# Altium schematic sheet FPGA HP BANK.SchDoc
size A3
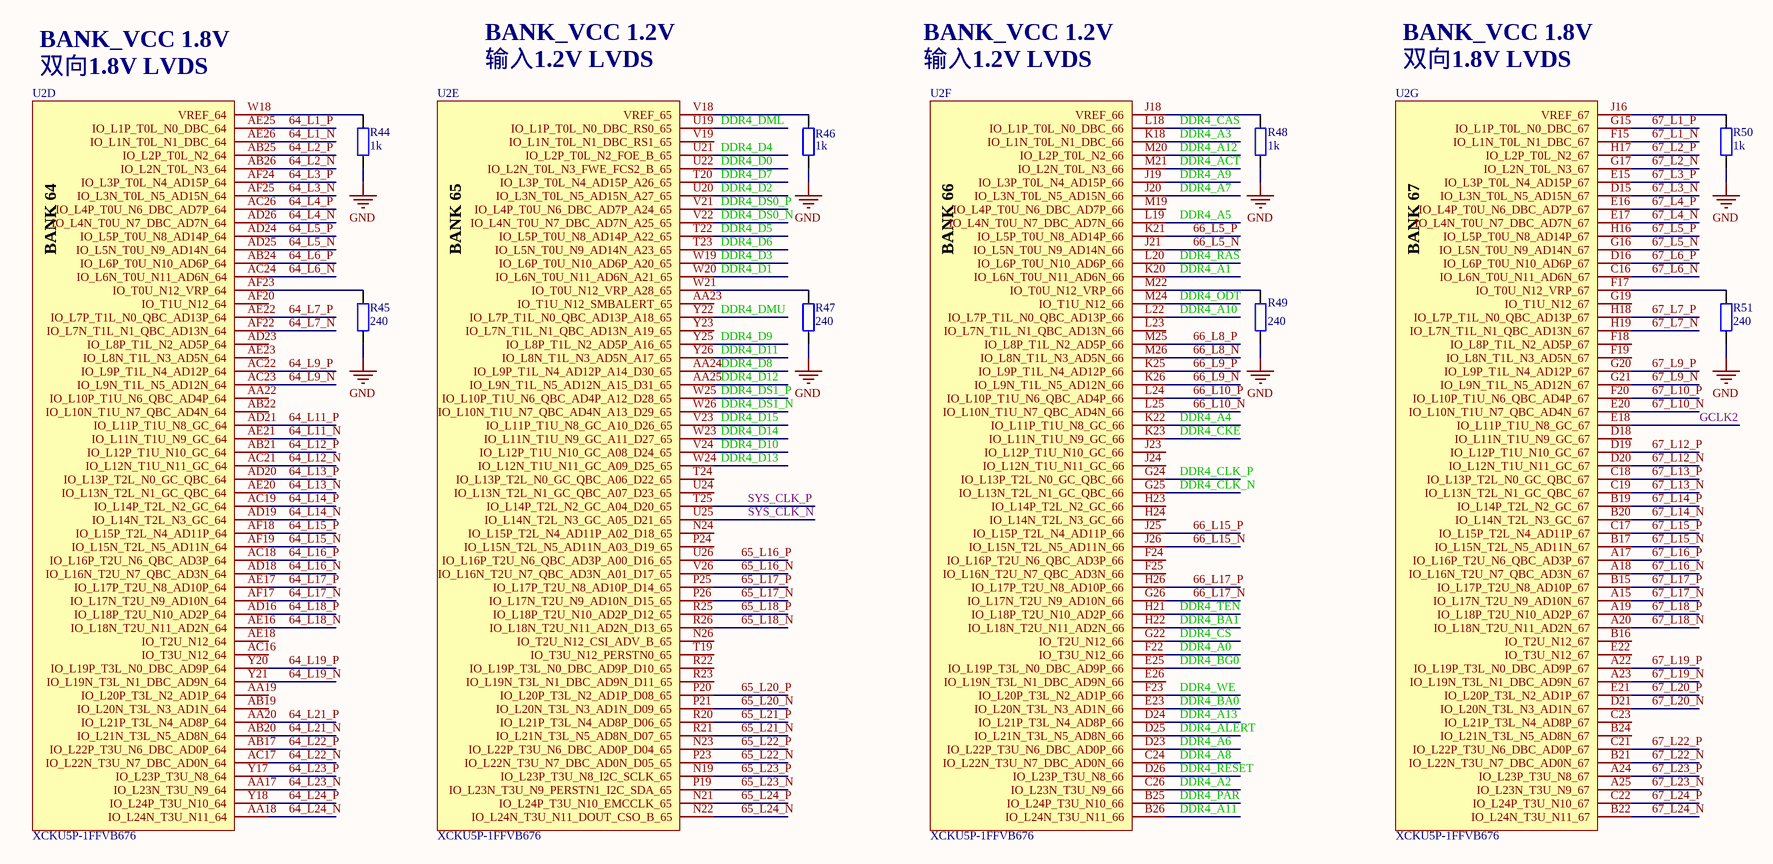
[diagram p0: FPGA HP BANK.SchDoc]

## Parts
R44  1k  [0402_R_M]
R45  240  [0402_R_M]
R46  1k  [0402_R_M]
R47  240  [0402_R_M]
R48  1k  [0402_R_M]
R49  240  [0402_R_M]
R50  1k  [0402_R_M]
R51  240  [0402_R_M]
U2  XCKU5P-1FFVB676  (parts D,E,F,G of 11)

## Nets
GND: R44.2 R45.2 R46.2 R47.2 R48.2 R49.2 R50.2 R51.2
64_L1_N: U2.AE26(IO_L1N_T0L_N1_DBC_64)
64_L1_P: U2.AE25(IO_L1P_T0L_N0_DBC_64)
64_L2_N: U2.AB26(IO_L2N_T0L_N3_64)
64_L2_P: U2.AB25(IO_L2P_T0L_N2_64)
64_L3_N: U2.AF25(IO_L3N_T0L_N5_AD15N_64)
64_L3_P: U2.AF24(IO_L3P_T0L_N4_AD15P_64)
64_L4_N: U2.AD26(IO_L4N_T0U_N7_DBC_AD7N_64)
64_L4_P: U2.AC26(IO_L4P_T0U_N6_DBC_AD7P_64)
64_L5_N: U2.AD25(IO_L5N_T0U_N9_AD14N_64)
64_L5_P: U2.AD24(IO_L5P_T0U_N8_AD14P_64)
64_L6_N: U2.AC24(IO_L6N_T0U_N11_AD6N_64)
64_L6_P: U2.AB24(IO_L6P_T0U_N10_AD6P_64)
64_L7_N: U2.AF22(IO_L7N_T1L_N1_QBC_AD13N_64)
64_L7_P: U2.AE22(IO_L7P_T1L_N0_QBC_AD13P_64)
64_L9_N: U2.AC23(IO_L9N_T1L_N5_AD12N_64)
64_L9_P: U2.AC22(IO_L9P_T1L_N4_AD12P_64)
64_L11_N: U2.AE21(IO_L11N_T1U_N9_GC_64)
64_L11_P: U2.AD21(IO_L11P_T1U_N8_GC_64)
64_L12_N: U2.AC21(IO_L12N_T1U_N11_GC_64)
64_L12_P: U2.AB21(IO_L12P_T1U_N10_GC_64)
64_L13_N: U2.AE20(IO_L13N_T2L_N1_GC_QBC_64)
64_L13_P: U2.AD20(IO_L13P_T2L_N0_GC_QBC_64)
64_L14_N: U2.AD19(IO_L14N_T2L_N3_GC_64)
64_L14_P: U2.AC19(IO_L14P_T2L_N2_GC_64)
64_L15_N: U2.AF19(IO_L15N_T2L_N5_AD11N_64)
64_L15_P: U2.AF18(IO_L15P_T2L_N4_AD11P_64)
64_L16_N: U2.AD18(IO_L16N_T2U_N7_QBC_AD3N_64)
64_L16_P: U2.AC18(IO_L16P_T2U_N6_QBC_AD3P_64)
64_L17_N: U2.AF17(IO_L17N_T2U_N9_AD10N_64)
64_L17_P: U2.AE17(IO_L17P_T2U_N8_AD10P_64)
64_L18_N: U2.AE16(IO_L18N_T2U_N11_AD2N_64)
64_L18_P: U2.AD16(IO_L18P_T2U_N10_AD2P_64)
64_L19_N: U2.Y21(IO_L19N_T3L_N1_DBC_AD9N_64)
64_L19_P: U2.Y20(IO_L19P_T3L_N0_DBC_AD9P_64)
64_L21_N: U2.AB20(IO_L21N_T3L_N5_AD8N_64)
64_L21_P: U2.AA20(IO_L21P_T3L_N4_AD8P_64)
64_L22_N: U2.AC17(IO_L22N_T3U_N7_DBC_AD0N_64)
64_L22_P: U2.AB17(IO_L22P_T3U_N6_DBC_AD0P_64)
64_L23_N: U2.AA17(IO_L23N_T3U_N9_64)
64_L23_P: U2.Y17(IO_L23P_T3U_N8_64)
64_L24_N: U2.AA18(IO_L24N_T3U_N11_64)
64_L24_P: U2.Y18(IO_L24P_T3U_N10_64)
65_L16_N: U2.V26(IO_L16N_T2U_N7_QBC_AD3N_A01_D17_65)
65_L16_P: U2.U26(IO_L16P_T2U_N6_QBC_AD3P_A00_D16_65)
65_L17_N: U2.P26(IO_L17N_T2U_N9_AD10N_D15_65)
65_L17_P: U2.P25(IO_L17P_T2U_N8_AD10P_D14_65)
65_L18_N: U2.R26(IO_L18N_T2U_N11_AD2N_D13_65)
65_L18_P: U2.R25(IO_L18P_T2U_N10_AD2P_D12_65)
65_L20_N: U2.P21(IO_L20N_T3L_N3_AD1N_D09_65)
65_L20_P: U2.P20(IO_L20P_T3L_N2_AD1P_D08_65)
65_L21_N: U2.R21(IO_L21N_T3L_N5_AD8N_D07_65)
65_L21_P: U2.R20(IO_L21P_T3L_N4_AD8P_D06_65)
65_L22_N: U2.P23(IO_L22N_T3U_N7_DBC_AD0N_D05_65)
65_L22_P: U2.N23(IO_L22P_T3U_N6_DBC_AD0P_D04_65)
65_L23_N: U2.P19(IO_L23N_T3U_N9_PERSTN1_I2C_SDA_65)
65_L23_P: U2.N19(IO_L23P_T3U_N8_I2C_SCLK_65)
65_L24_N: U2.N22(IO_L24N_T3U_N11_DOUT_CSO_B_65)
65_L24_P: U2.N21(IO_L24P_T3U_N10_EMCCLK_65)
66_L5_N: U2.J21(IO_L5N_T0U_N9_AD14N_66)
66_L5_P: U2.K21(IO_L5P_T0U_N8_AD14P_66)
66_L8_N: U2.M26(IO_L8N_T1L_N3_AD5N_66)
66_L8_P: U2.M25(IO_L8P_T1L_N2_AD5P_66)
66_L9_N: U2.K26(IO_L9N_T1L_N5_AD12N_66)
66_L9_P: U2.K25(IO_L9P_T1L_N4_AD12P_66)
66_L10_N: U2.L25(IO_L10N_T1U_N7_QBC_AD4N_66)
66_L10_P: U2.L24(IO_L10P_T1U_N6_QBC_AD4P_66)
66_L15_N: U2.J26(IO_L15N_T2L_N5_AD11N_66)
66_L15_P: U2.J25(IO_L15P_T2L_N4_AD11P_66)
66_L17_N: U2.G26(IO_L17N_T2U_N9_AD10N_66)
66_L17_P: U2.H26(IO_L17P_T2U_N8_AD10P_66)
67_L1_N: U2.F15(IO_L1N_T0L_N1_DBC_67)
67_L1_P: U2.G15(IO_L1P_T0L_N0_DBC_67)
67_L2_N: U2.G17(IO_L2N_T0L_N3_67)
67_L2_P: U2.H17(IO_L2P_T0L_N2_67)
67_L3_N: U2.D15(IO_L3N_T0L_N5_AD15N_67)
67_L3_P: U2.E15(IO_L3P_T0L_N4_AD15P_67)
67_L4_N: U2.E17(IO_L4N_T0U_N7_DBC_AD7N_67)
67_L4_P: U2.E16(IO_L4P_T0U_N6_DBC_AD7P_67)
67_L5_N: U2.G16(IO_L5N_T0U_N9_AD14N_67)
67_L5_P: U2.H16(IO_L5P_T0U_N8_AD14P_67)
67_L6_N: U2.C16(IO_L6N_T0U_N11_AD6N_67)
67_L6_P: U2.D16(IO_L6P_T0U_N10_AD6P_67)
67_L7_N: U2.H19(IO_L7N_T1L_N1_QBC_AD13N_67)
67_L7_P: U2.H18(IO_L7P_T1L_N0_QBC_AD13P_67)
67_L9_N: U2.G21(IO_L9N_T1L_N5_AD12N_67)
67_L9_P: U2.G20(IO_L9P_T1L_N4_AD12P_67)
67_L10_N: U2.E20(IO_L10N_T1U_N7_QBC_AD4N_67)
67_L10_P: U2.F20(IO_L10P_T1U_N6_QBC_AD4P_67)
67_L12_N: U2.D20(IO_L12N_T1U_N11_GC_67)
67_L12_P: U2.D19(IO_L12P_T1U_N10_GC_67)
67_L13_N: U2.C19(IO_L13N_T2L_N1_GC_QBC_67)
67_L13_P: U2.C18(IO_L13P_T2L_N0_GC_QBC_67)
67_L14_N: U2.B20(IO_L14N_T2L_N3_GC_67)
67_L14_P: U2.B19(IO_L14P_T2L_N2_GC_67)
67_L15_N: U2.B17(IO_L15N_T2L_N5_AD11N_67)
67_L15_P: U2.C17(IO_L15P_T2L_N4_AD11P_67)
67_L16_N: U2.A18(IO_L16N_T2U_N7_QBC_AD3N_67)
67_L16_P: U2.A17(IO_L16P_T2U_N6_QBC_AD3P_67)
67_L17_N: U2.A15(IO_L17N_T2U_N9_AD10N_67)
67_L17_P: U2.B15(IO_L17P_T2U_N8_AD10P_67)
67_L18_N: U2.A20(IO_L18N_T2U_N11_AD2N_67)
67_L18_P: U2.A19(IO_L18P_T2U_N10_AD2P_67)
67_L19_N: U2.A23(IO_L19N_T3L_N1_DBC_AD9N_67)
67_L19_P: U2.A22(IO_L19P_T3L_N0_DBC_AD9P_67)
67_L20_N: U2.D21(IO_L20N_T3L_N3_AD1N_67)
67_L20_P: U2.E21(IO_L20P_T3L_N2_AD1P_67)
67_L22_N: U2.B21(IO_L22N_T3U_N7_DBC_AD0N_67)
67_L22_P: U2.C21(IO_L22P_T3U_N6_DBC_AD0P_67)
67_L23_N: U2.A25(IO_L23N_T3U_N9_67)
67_L23_P: U2.A24(IO_L23P_T3U_N8_67)
67_L24_N: U2.B22(IO_L24N_T3U_N11_67)
67_L24_P: U2.C22(IO_L24P_T3U_N10_67)
DDR4_A0: U2.F22(IO_T3U_N12_66)
DDR4_A1: U2.K20(IO_L6N_T0U_N11_AD6N_66)
DDR4_A2: U2.C26(IO_L23N_T3U_N9_66)
DDR4_A3: U2.K18(IO_L1N_T0L_N1_DBC_66)
DDR4_A4: U2.K22(IO_L11P_T1U_N8_GC_66)
DDR4_A5: U2.L19(IO_L4N_T0U_N7_DBC_AD7N_66)
DDR4_A6: U2.D23(IO_L22P_T3U_N6_DBC_AD0P_66)
DDR4_A7: U2.J20(IO_L3N_T0L_N5_AD15N_66)
DDR4_A8: U2.C24(IO_L22N_T3U_N7_DBC_AD0N_66)
DDR4_A9: U2.J19(IO_L3P_T0L_N4_AD15P_66)
DDR4_A10: U2.L22(IO_L7P_T1L_N0_QBC_AD13P_66)
DDR4_A11: U2.B26(IO_L24N_T3U_N11_66)
DDR4_A12: U2.M20(IO_L2P_T0L_N2_66)
DDR4_A13: U2.D24(IO_L21P_T3L_N4_AD8P_66)
DDR4_ACT: U2.M21(IO_L2N_T0L_N3_66)
DDR4_ALERT: U2.D25(IO_L21N_T3L_N5_AD8N_66)
DDR4_BA0: U2.E23(IO_L20N_T3L_N3_AD1N_66)
DDR4_BA1: U2.H22(IO_L18N_T2U_N11_AD2N_66)
DDR4_BG0: U2.E25(IO_L19P_T3L_N0_DBC_AD9P_66)
DDR4_CAS: U2.L18(IO_L1P_T0L_N0_DBC_66)
DDR4_CKE: U2.K23(IO_L11N_T1U_N9_GC_66)
DDR4_CLK_N: U2.G25(IO_L13N_T2L_N1_GC_QBC_66)
DDR4_CLK_P: U2.G24(IO_L13P_T2L_N0_GC_QBC_66)
DDR4_CS: U2.G22(IO_T2U_N12_66)
DDR4_D0: U2.U22(IO_L2N_T0L_N3_FWE_FCS2_B_65)
DDR4_D1: U2.W20(IO_L6N_T0U_N11_AD6N_A21_65)
DDR4_D2: U2.U20(IO_L3N_T0L_N5_AD15N_A27_65)
DDR4_D3: U2.W19(IO_L6P_T0U_N10_AD6P_A20_65)
DDR4_D4: U2.U21(IO_L2P_T0L_N2_FOE_B_65)
DDR4_D5: U2.T22(IO_L5P_T0U_N8_AD14P_A22_65)
DDR4_D6: U2.T23(IO_L5N_T0U_N9_AD14N_A23_65)
DDR4_D7: U2.T20(IO_L3P_T0L_N4_AD15P_A26_65)
DDR4_D8: U2.AA24(IO_L9P_T1L_N4_AD12P_A14_D30_65)
DDR4_D9: U2.Y25(IO_L8P_T1L_N2_AD5P_A16_65)
DDR4_D10: U2.V24(IO_L12P_T1U_N10_GC_A08_D24_65)
DDR4_D11: U2.Y26(IO_L8N_T1L_N3_AD5N_A17_65)
DDR4_D12: U2.AA25(IO_L9N_T1L_N5_AD12N_A15_D31_65)
DDR4_D13: U2.W24(IO_L12N_T1U_N11_GC_A09_D25_65)
DDR4_D14: U2.W23(IO_L11N_T1U_N9_GC_A11_D27_65)
DDR4_D15: U2.V23(IO_L11P_T1U_N8_GC_A10_D26_65)
DDR4_DML: U2.U19(IO_L1P_T0L_N0_DBC_RS0_65)
DDR4_DMU: U2.Y22(IO_L7P_T1L_N0_QBC_AD13P_A18_65)
DDR4_DS0_N: U2.V22(IO_L4N_T0U_N7_DBC_AD7N_A25_65)
DDR4_DS0_P: U2.V21(IO_L4P_T0U_N6_DBC_AD7P_A24_65)
DDR4_DS1_N: U2.W26(IO_L10N_T1U_N7_QBC_AD4N_A13_D29_65)
DDR4_DS1_P: U2.W25(IO_L10P_T1U_N6_QBC_AD4P_A12_D28_65)
DDR4_ODT: U2.M24(IO_T1U_N12_66)
DDR4_PAR: U2.B25(IO_L24P_T3U_N10_66)
DDR4_RAS: U2.L20(IO_L6P_T0U_N10_AD6P_66)
DDR4_RESET: U2.D26(IO_L23P_T3U_N8_66)
DDR4_TEN: U2.H21(IO_L18P_T2U_N10_AD2P_66)
DDR4_WE: U2.F23(IO_L20P_T3L_N2_AD1P_66)
GCLK2: U2.E18(IO_L11P_T1U_N8_GC_67)
SYS_CLK_N: U2.U25(IO_L14N_T2L_N3_GC_A05_D21_65)
SYS_CLK_P: U2.T25(IO_L14P_T2L_N2_GC_A04_D20_65)
NetR44_1: R44.1 U2.W18(VREF_64)
NetR45_1: R45.1 U2.AF23(IO_T0U_N12_VRP_64)
NetR46_1: R46.1 U2.V18(VREF_65)
NetR47_1: R47.1 U2.W21(IO_T0U_N12_VRP_A28_65)
NetR48_1: R48.1 U2.J18(VREF_66)
NetR49_1: R49.1 U2.M22(IO_T0U_N12_VRP_66)
NetR50_1: R50.1 U2.J16(VREF_67)
NetR51_1: R51.1 U2.F17(IO_T0U_N12_VRP_67)

Not connected (* = marked no-connect by the designer): U2 AA19(IO_L20P_T3L_N2_AD1P_64) AA22(IO_L10P_T1U_N6_QBC_AD4P_64) AA23(IO_T1U_N12_SMBALERT_65) AB19(IO_L20N_T3L_N3_AD1N_64) AB22(IO_L10N_T1U_N7_QBC_AD4N_64) AC16(IO_T3U_N12_64) AD23(IO_L8P_T1L_N2_AD5P_64) AE18(IO_T2U_N12_64) AE23(IO_L8N_T1L_N3_AD5N_64) AF20(IO_T1U_N12_64) B16(IO_T2U_N12_67) B24(IO_L21N_T3L_N5_AD8N_67) C23(IO_L21P_T3L_N4_AD8P_67) D18(IO_L11N_T1U_N9_GC_67) E22(IO_T3U_N12_67) E26(IO_L19N_T3L_N1_DBC_AD9N_66) F18(IO_L8P_T1L_N2_AD5P_67) F19(IO_L8N_T1L_N3_AD5N_67) F24(IO_L16P_T2U_N6_QBC_AD3P_66) F25(IO_L16N_T2U_N7_QBC_AD3N_66) G19(IO_T1U_N12_67) H23(IO_L14P_T2L_N2_GC_66) H24(IO_L14N_T2L_N3_GC_66) J23(IO_L12P_T1U_N10_GC_66) J24(IO_L12N_T1U_N11_GC_66) L23(IO_L7N_T1L_N1_QBC_AD13N_66) M19(IO_L4P_T0U_N6_DBC_AD7P_66) N24(IO_L15P_T2L_N4_AD11P_A02_D18_65) N26(IO_T2U_N12_CSI_ADV_B_65) P24(IO_L15N_T2L_N5_AD11N_A03_D19_65) R22(IO_L19P_T3L_N0_DBC_AD9P_D10_65) R23(IO_L19N_T3L_N1_DBC_AD9N_D11_65) T19(IO_T3U_N12_PERSTN0_65) T24(IO_L13P_T2L_N0_GC_QBC_A06_D22_65) U24(IO_L13N_T2L_N1_GC_QBC_A07_D23_65) V19(IO_L1N_T0L_N1_DBC_RS1_65) Y23(IO_L7N_T1L_N1_QBC_AD13N_A19_65)

## Notes on the sheet
- BANK_VCC 1.2V
- BANK_VCC 1.8V
- 双向1.8V LVDS
- 输入1.2V LVDS
- (in symbol XCKU5P-FFVB676, part D) BANK 64
- (in symbol XCKU5P-FFVB676, part E) BANK 65
- (in symbol XCKU5P-FFVB676, part F) BANK 66
- (in symbol XCKU5P-FFVB676, part G) BANK 67

## Library data of the parts
R44-R51 = RES2
U2 = XCKU5P-FFVB676